# Altium schematic sheet Blockschaltbild.SchDoc: ULPWUR
size A3; Date: 11.11.2019; Author: Cédric Renda; CompanyName: HSR; DrawnBy: Cédric Renda; Organization: HSR
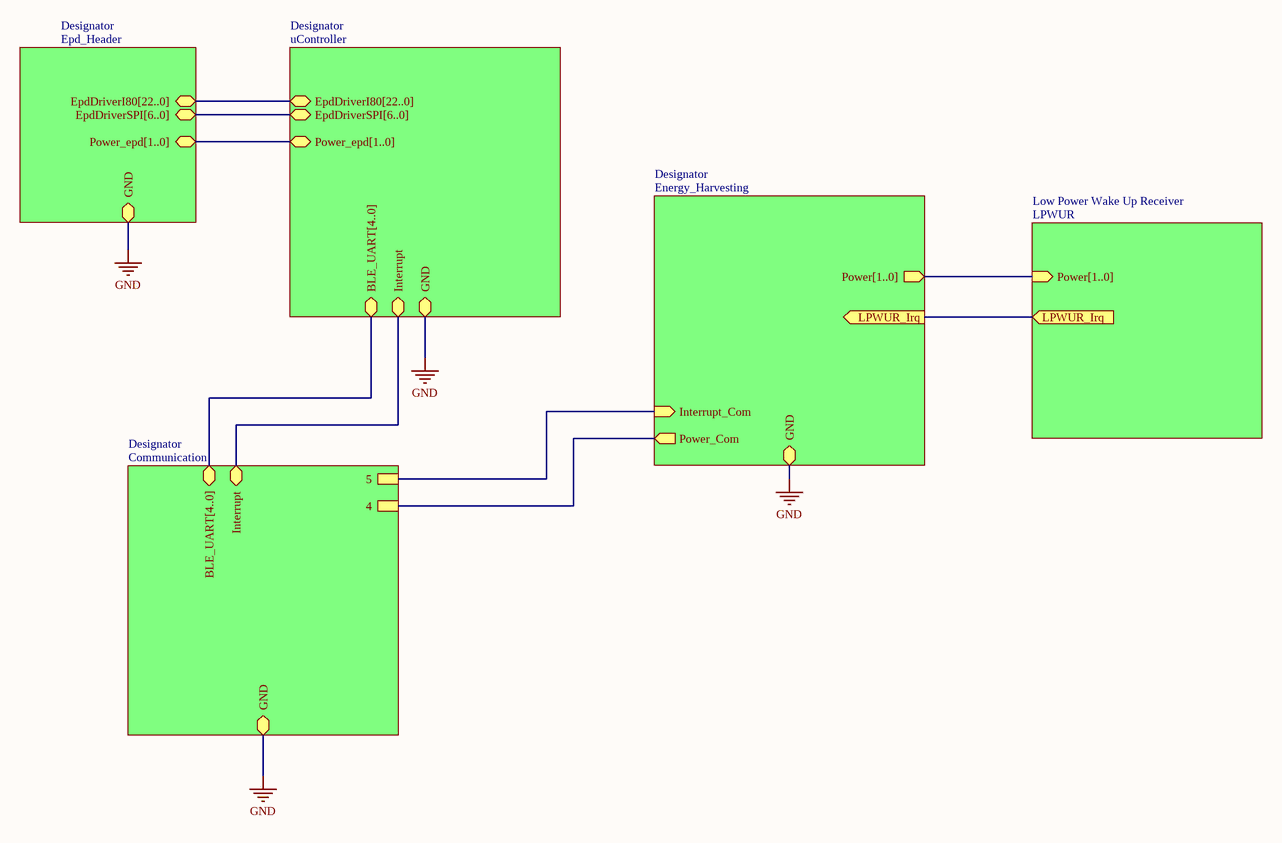
[diagram p0: Blockschaltbild.SchDoc]

## Sub-sheets
Designator = Epd_Header: GND (bidir), Power_epd[1..0] (bidir), EpdDriverI80[22..0] (bidir), EpdDriverSPI[6..0] (bidir)
Designator = uController: Interrupt (bidir), Power_epd[1..0] (bidir), GND (bidir), EpdDriverI80[22..0] (bidir), BLE_UART[4..0] (bidir), EpdDriverSPI[6..0] (bidir)
Designator = Communication: 4, 5, Interrupt (bidir), GND (bidir), BLE_UART[4..0] (bidir)
Designator = Energy_Harvesting: Power_Com (out), Interrupt_Com (in), GND (bidir), Power[1..0] (out)
Low Power Wake Up Receiver = LPWUR: Power[1..0] (in)

## Ports
LPWUR_Irq (in), LPWUR_Irq (out)

## Nets
GND: sheet Designator/GND, sheet Designator/GND, sheet Designator/GND, sheet Designator/GND
(unnamed): sheet Designator/Interrupt, sheet Designator/Interrupt
(unnamed): sheet Designator/4, sheet Designator/Power_Com
(unnamed): sheet Designator/5, sheet Designator/Interrupt_Com

## Buses and harness runs
bus sheet Designator/Power[1..0] = sheet Low Power Wake Up Receiver/Power[1..0]